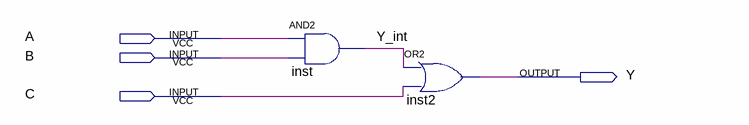
[diagram p0: schematic sheet]
// Quartus schematic tutorial_1.bdf as structural Verilog: 2 symbols, 4 pins
module tutorial_1 (
  input  A,
  input  B,
  input  C,
  output Y
);

  wire Y_int;

  and inst (Y_int, A, B);
  or inst2 (Y, Y_int, C);
endmodule
